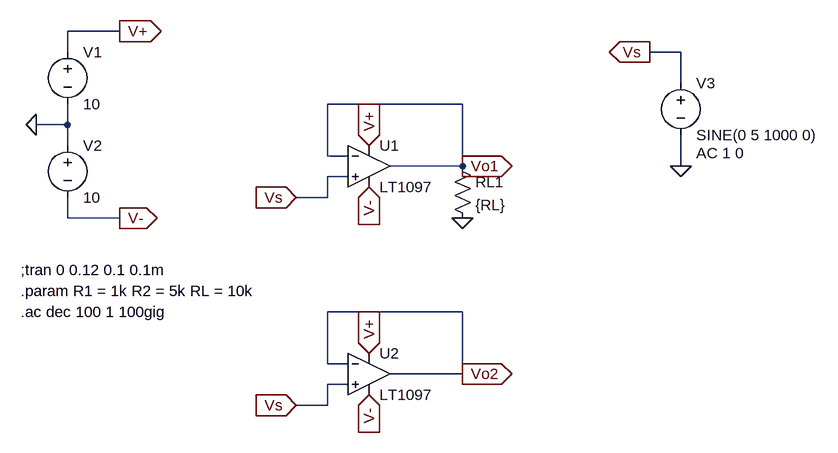
[diagram p0: schematic buffer.asc]
buffer.asc, the LTspice schematic file:
Version 4
SHEET 1 1244 680
WIRE 128 -144 48 -144
WIRE 48 -112 48 -144
WIRE 992 -112 944 -112
WIRE 992 -64 992 -112
WIRE 656 -32 448 -32
WIRE 48 0 48 -32
WIRE 48 0 0 0
WIRE 48 32 48 0
WIRE 448 48 448 -32
WIRE 480 48 448 48
WIRE 656 64 656 -32
WIRE 656 64 544 64
WIRE 992 64 992 16
WIRE 480 80 448 80
WIRE 448 112 448 80
WIRE 448 112 400 112
WIRE 48 144 48 112
WIRE 128 144 48 144
WIRE 656 288 448 288
WIRE 448 368 448 288
WIRE 480 368 448 368
WIRE 656 384 656 288
WIRE 656 384 544 384
WIRE 480 400 448 400
WIRE 448 432 448 400
WIRE 448 432 400 432
FLAG 512 32 V+
IOPIN 512 32 In
FLAG 512 96 V-
IOPIN 512 96 In
FLAG 400 112 Vs
IOPIN 400 112 In
FLAG 656 144 0
FLAG 0 0 0
FLAG 128 -144 V+
IOPIN 128 -144 Out
FLAG 128 144 V-
IOPIN 128 144 Out
FLAG 992 64 0
FLAG 944 -112 Vs
IOPIN 944 -112 Out
FLAG 512 352 V+
IOPIN 512 352 In
FLAG 512 416 V-
IOPIN 512 416 In
FLAG 400 432 Vs
IOPIN 400 432 In
FLAG 656 64 Vo1
IOPIN 656 64 Out
FLAG 656 384 Vo2
IOPIN 656 384 Out
SYMBOL OpAmps\\LT1097 512 0 R0
SYMATTR InstName U1
SYMBOL res 640 48 R0
SYMATTR InstName RL1
SYMATTR Value {RL}
SYMBOL voltage 48 -128 R0
SYMATTR InstName V1
SYMATTR Value 10
SYMBOL voltage 48 16 R0
SYMATTR InstName V2
SYMATTR Value 10
SYMBOL voltage 992 -80 R0
WINDOW 123 24 124 Left 2
WINDOW 39 0 0 Left 0
SYMATTR Value2 AC 1 0
SYMATTR InstName V3
SYMATTR Value SINE(0 5 1000 0)
SYMBOL OpAmps\\LT1097 512 320 R0
SYMATTR InstName U2
TEXT -24 224 Left 2 !;tran 0 0.12 0.1 0.1m
TEXT -24 256 Left 2 !.param R1 = 1k R2 = 5k RL = 10k
TEXT -24 288 Left 2 !.ac dec 100 1 100gig

The netlist it stands for:
* buffer.asc
XU1 Vs Vo1 V+ V- Vo1 LT1097  ; pins In+ In- V+ V- OUT
RL1 Vo1 0 {RL}
V1 V+ 0 10
V2 0 V- 10
V3 Vs 0 SINE(0 5 1000 0) AC 1 0
XU2 Vs Vo2 V+ V- Vo2 LT1097  ; pins In+ In- V+ V- OUT
;tran 0 0.12 0.1 0.1m
.param R1 = 1k R2 = 5k RL = 10k
.ac dec 100 1 100gig
.backanno
.end